# Altium project Booster.PrjPCB
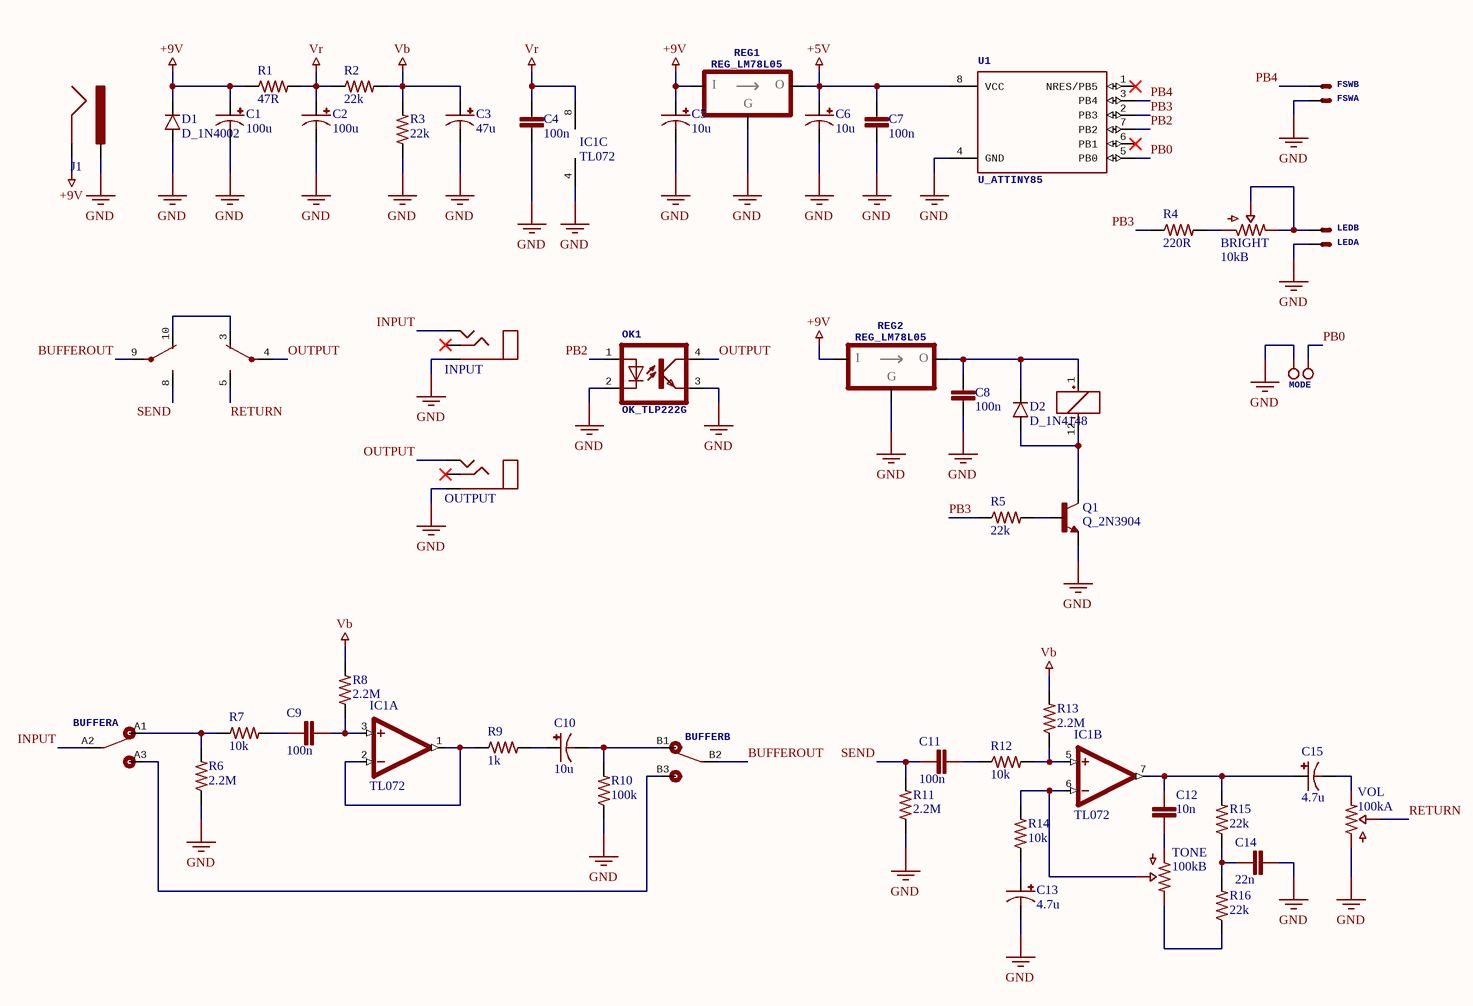
[diagram p0: Booster.SchDoc]
1 sheet, 50 parts. Net scope: global (net labels, ports and power ports of the same name join across sheets).
Board file: Booster.PcbDoc

## Sheet Booster.SchDoc
size 381 x 241 mm

### Parts
BRIGHT  10kB  [BOURNS_3362P]
BUFFER  DPDT  [DPDT_SLIDE]  (value not drawn)  (parts A,B of 2)
C1  100u  [ELEC_063_025]
C2  100u  [ELEC_063_025]
C3  47u  [ELEC_050_020]
C4  100n  [CER_050]
C5  10u  [ELEC_050_020]
C6  10u  [ELEC_050_020]
C7  100n  [CER_050]
C8  100n  [CER_050]
C9  100n  [FILMBOX_SMALL]
C10  10u  [ELEC_LESR_050_020]
C11  100n  [FILMBOX_SMALL]
C12  10n  [FILMBOX_SMALL]
C13  4.7u  [ELEC_LESR_050_020]
C14  22n  [FILMBOX_SMALL]
C15  4.7u  [ELEC_LESR_050_020]
D1  D_1N4002  [DO41_2]
D2  D_1N4148  [DO35_2]
FSW  J_JST-XH-02  [JST-XH-02]  (value not drawn)  (parts A,B of 2)
IC1  TL072  [DIL8]  (parts A,B,C of 3)
INPUT  J_STEREO  [STEREO]  (value not drawn)
J1  J_DC_JACK  [DC_JACK]  (value not drawn)
K1  K_NA5W-K  [NA5]  (value not drawn)  (parts A,B,C of 3)
LED  J_JST-XH-02  [JST-XH-02]  (value not drawn)  (parts A,B of 2)
MODE  J_HEADER_2PINS  [HEADER_2PINS]  (value not drawn)
OK1  OK_TLP222G  [DIL4]
OUTPUT  J_STEREO  [STEREO]  (value not drawn)
Q1  Q_2N3904  [TO92]
R1  47R  [R_3_47R_025W]
R2  22k  [R_3_22k_025W]
R3  22k  [R_3_22k_025W]
R4  220R  [R_3_220R_025W]
R5  22k  [R_3_22k_025W]
R6  2.2M  [R_3_2,2M_025W]
R7  10k  [R_3_10k_025W]
R8  2.2M  [R_3_2,2M_025W]
R9  1k  [R_3_1k_025W]
R10  100k  [R_3_100k_025W]
R11  2.2M  [R_3_2,2M_025W]
R12  10k  [R_3_10k_025W]
R13  2.2M  [R_3_2,2M_025W]
R14  10k  [R_3_10k_025W]
R15  22k  [R_3_22k_025W]
R16  22k  [R_3_22k_025W]
REG1  REG_LM78L05  [TO92]
REG2  REG_LM78L05  [TO92]
TONE  100kB  [ALPHA_16mm_BOTTOM]
U1  U_ATTINY85  [DIP8]
VOL  100kA  [ALPHA_16mm_BOTTOM]

### Nets
+5V: C6.+ C7.2 REG1.3(VO) U1.8(VCC)
+9V: C1.+ C5.+ D1.C J1.GND R1.1 REG1.1(VI) REG2.1(VI)
GND: C1.- C2.- C3.- C4.2 C5.- C6.- C7.1 C8.2 C13.- C14.1 D1.A FSW.2(S) IC1.4(V-) INPUT.S J1.PWR LED.2(S) MODE.1 OK1.2(C) OK1.3(EMIT) OUTPUT.S Q1.3(E) R3.1 R6.1 R10.1 R11.1 REG1.2(GND) REG2.2(GND) U1.4(GND) VOL.1
Vb: C3.+ R2.2 R3.2 R8.2 R13.2
Vr: C2.+ C4.1 IC1.8(V+) R1.2 R2.1
BUFFEROUT: BUFFER.B2 K1.9(P)
INPUT: BUFFER.A2 INPUT.T
OUTPUT: K1.4(P) OK1.4(COL) OUTPUT.T
PB0: MODE.2 U1.5(PB0)
PB2: OK1.1(A) U1.7(PB2)
PB3: R4.1 R5.1 U1.2(PB3)
PB4: FSW.1(S) U1.3(PB4)
RETURN: K1.5(S) VOL.2
SEND: C11.2 K1.8(S) R11.2
NetBRIGHT_1: BRIGHT.1 R4.2
NetBRIGHT_2: BRIGHT.2 BRIGHT.3 LED.1(S)
NetBUFFER_A1: BUFFER.A1 R6.2 R7.1
NetBUFFER_A3: BUFFER.A3 BUFFER.B3
NetBUFFER_B1: BUFFER.B1 C10.- R10.2
NetC8_1: C8.1 D2.C K1.1(+) REG2.3(VO)
NetC9_1: C9.1 IC1.3(+IN) R8.1
NetC9_2: C9.2 R7.2
NetC10_+: C10.+ R9.2
NetC11_1: C11.1 R12.1
NetC12_1: C12.1 C15.+ IC1.7(OUT) R15.2
NetC12_2: C12.2 TONE.1
NetC13_+: C13.+ R14.1
NetC14_2: C14.2 R15.1 R16.2
NetC15_-: C15.- VOL.3
NetD2_A: D2.A K1.12(-) Q1.1(C)
NetIC1_1: IC1.1(OUT) IC1.2(-IN) R9.1
NetIC1_5: IC1.5(+IN) R12.2 R13.1
NetIC1_6: IC1.6(-IN) R14.2 TONE.2
NetK1_3: K1.3(O) K1.10(O)
NetQ1_2: Q1.2(B) R5.2
NetR16_1: R16.1 TONE.3

Not connected (* = marked no-connect by the designer): INPUT R*; OUTPUT R*; U1 1(NRES/PB5)* 6(PB1)*

### Notes on the sheet
- (in symbol REG_LM78L05) I; O; G

### Library data of the parts
BRIGHT = TRIM_10kB_3362P: 10k Lin 3362P trimmer; Price: 0.1
BUFFER = SW_SLIDE_DPDT_ON-ON: DPDT slide switch ON/ON; Price: 0.5
C1 C2 = C_ELEC_100u_25V: 100u 25V electrolytic capacitor; PinSpacing: 2.54mm; Dimensions: 6.3x8mm; Package: Radial; Price: 0.02
C3 = C_ELEC_47u_25V: 47u 25V electrolytic capacitor; PinSpacing: 2mm; Dimensions: 5x8mm; Package: Radial; Price: 0.02
C4 C7 C8 = C_CER_100n: 100n MLCC X7R radial capacitor; PinSpacing: 5.08mm; Price: 0.02; Package: Radial
C5 C6 = C_ELEC_10u_50V: 10u 50V electrolytic capacitor; PinSpacing: 2mm; Dimensions: 4x8mm; Package: Radial; Price: 0.02
C9 C11 = C_FILMBOX_100n: 100n 100V polyester film box capacitor; PinSpacing: 5.08mm; Price: 0.05; Dimensions: 7.2x2.5x6.5mm; Package: Radial
C10 = C_ELEC_LESR_10u_50V: 10u 50V Low ESR ectrolytic capacitor; PinSpacing: 2mm; Price: 0.05; Dimensions: 5x11mm; Package: Radial
C12 = C_FILMBOX_10n: 10n 100V polyester film box capacitor; PinSpacing: 5.08mm; Price: 0.05; Dimensions: 7.2x2.5x6.5mm; Package: Radial
C13 C15 = C_ELEC_LESR_4.7u_50V: 4.7u 50V Low ESR ectrolytic capacitor; PinSpacing: 2mm; Price: 0.05; Dimensions: 5x11mm; Package: Radial
C14 = C_FILMBOX_22n: 22n 100V polyester film box capacitor; PinSpacing: 5.08mm; Price: 0.05; Dimensions: 7.2x2.5x6.5mm; Package: Radial
D1 = D_1N4002: 1N4002; PinSpacing: 7.62mm; Package: DO-41; Price: 0.01
D2 = D_1N4148: 1N4148; PinSpacing: 5.08mm; Price: 0.01; Package: DO-35
FSW LED = J_JST-XH-02: 2 Pins male XH header; Price: 0.1
IC1 = IC_TL072: Price: 0.1; Package: DIP-8
INPUT OUTPUT = J_STEREO: 6.35mm stereo insulated socket jack PCB mounted; Price: 0.5
J1 = J_DC_JACK: DC Power jack 2.1mm barrel; Price: 0.05
K1 = K_NA5W-K: NA5W-K; Price: 1.1
MODE = J_HEADER_2PINS: 2 Pins male header; Pin spacing: 2.54mm; Price: 0.01
OK1 = OK_TLP222G: TLP222G; Price: 0.36
Q1 = Q_2N3904: 2N3904; Package: TO-92; Price: 0.01
R1 = R_3_47R_025W: 47R metal film 1/4W Resistor; PinSpacing: 7.62mm; Price: 0.01
R2 R3 R5 R15 R16 = R_3_22k_025W: 22k metal film 1/4W Resistor; PinSpacing: 7.62mm; Price: 0.01
R4 = R_3_220R_025W: 220R metal film 1/4W Resistor; PinSpacing: 7.62mm; Price: 0.01
R6 R8 R11 R13 = R_3_2.2M_025W: 2.2M metal film 1/4W Resistor; PinSpacing: 7.62mm; Price: 0.01
R7 R12 R14 = R_3_10k_025W: 10k metal film 1/4W Resistor; PinSpacing: 7.62mm; Price: 0.01
R9 = R_3_1k_025W: 1k metal film 1/4W Resistor; PinSpacing: 7.62mm; Price: 0.01
R10 = R_3_100k_025W: 100k metal film 1/4W Resistor; PinSpacing: 7.62mm; Price: 0.01
REG1 REG2 = REG_LM78L05: 78L05; Package: TO-92; Price: 0.01
TONE = POT_100kB_ALPHA_16mm: 100k Lin potentiometer round shaft; Price: 0.5; Dimensions: 16mm; Package: PCB Mounted
U1 = U_ATTINY85: ATTINY85-20PU; Package: DIP-8; Price: 1.2
VOL = POT_100kA_ALPHA_16mm: 100k Log potentiometer round shaft; Price: 0.5; Dimensions: 16mm; Package: PCB Mounted